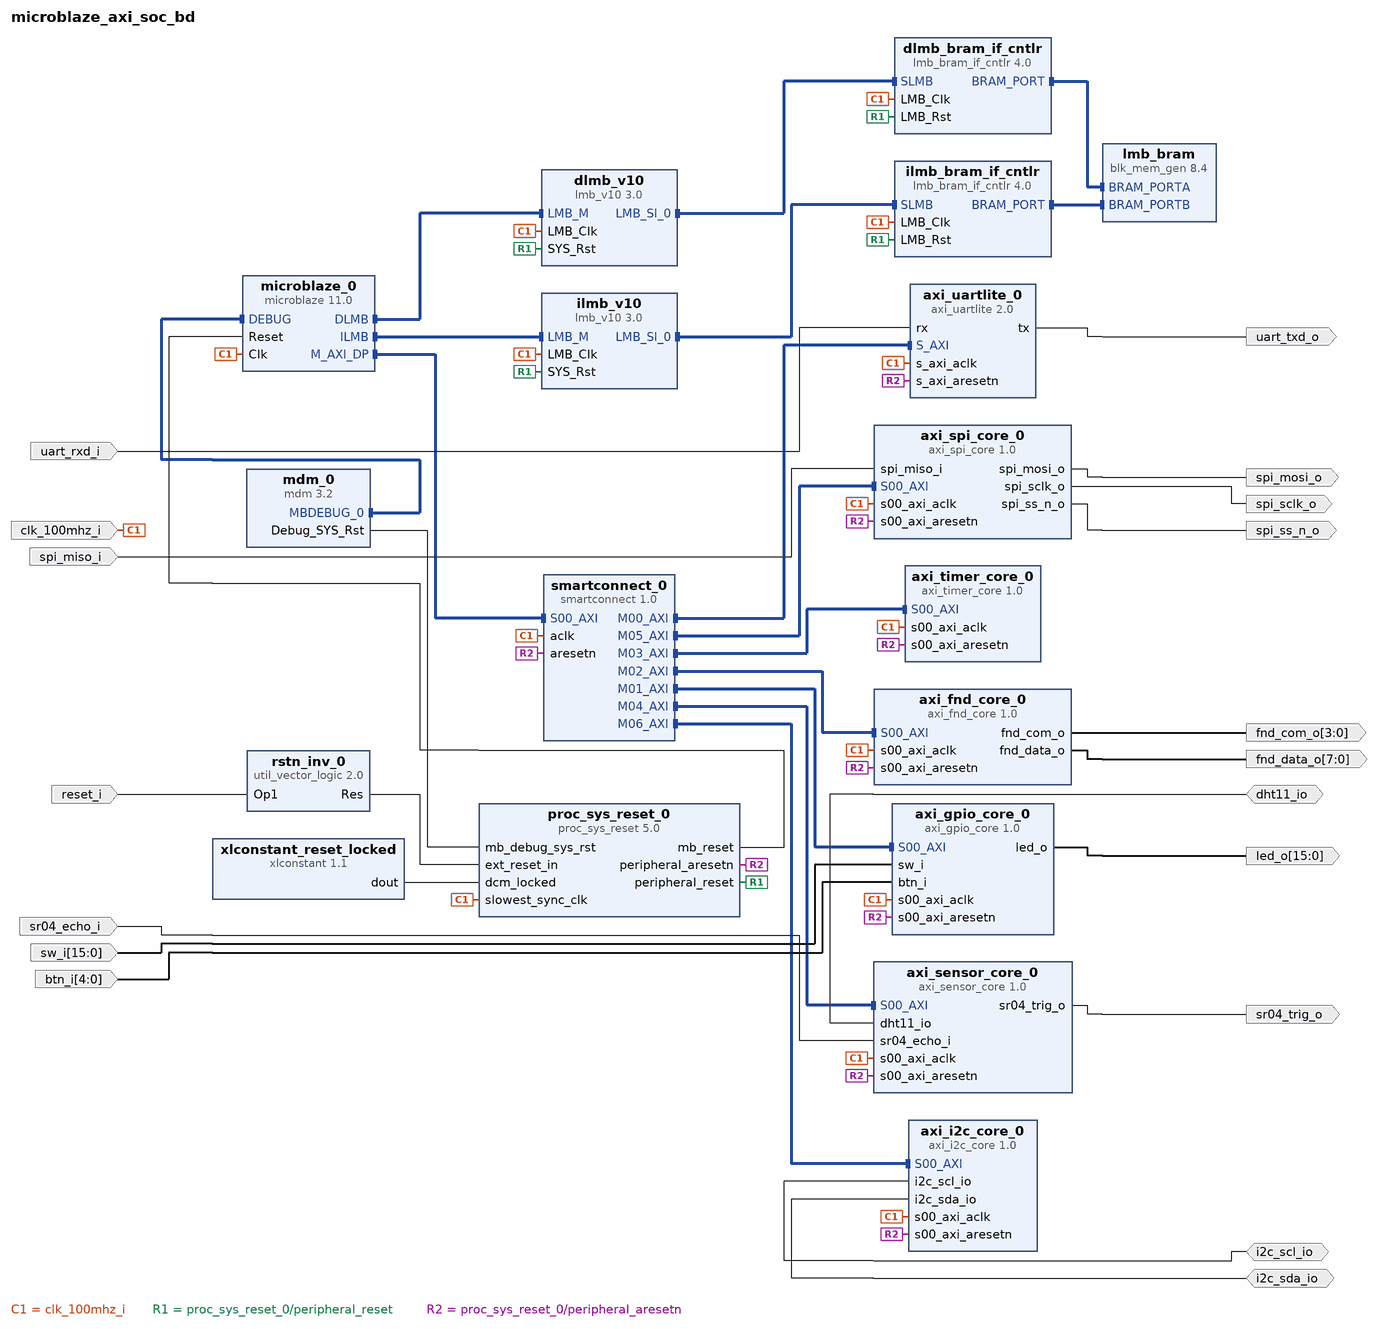
[diagram p0: block diagram of the top level]
# Vivado block design microblaze_axi_soc_bd, xc7a35tcpg236-1, Vivado 2020.2
create_bd_design microblaze_axi_soc_bd

create_bd_port -dir I -type clk clk_100mhz_i
set_property -dict {CONFIG.FREQ_HZ 100000000} [get_bd_ports clk_100mhz_i]
create_bd_port -dir I -type rst reset_i
set_property -dict {CONFIG.POLARITY ACTIVE_LOW} [get_bd_ports reset_i]
create_bd_port -dir I uart_rxd_i
create_bd_port -dir O uart_txd_o
create_bd_port -dir O -from 15 -to 0 led_o
create_bd_port -dir I -from 15 -to 0 sw_i
create_bd_port -dir I -from 4 -to 0 btn_i
create_bd_port -dir O -from 3 -to 0 fnd_com_o
create_bd_port -dir O -from 7 -to 0 fnd_data_o
create_bd_port -dir I sr04_echo_i
create_bd_port -dir O sr04_trig_o
create_bd_port -dir IO dht11_io
create_bd_port -dir O spi_sclk_o
create_bd_port -dir O spi_mosi_o
create_bd_port -dir I spi_miso_i
create_bd_port -dir O spi_ss_n_o
create_bd_port -dir IO i2c_scl_io
create_bd_port -dir IO i2c_sda_io

create_bd_cell -type ip -vlnv xilinx.com:ip:microblaze:11.0 microblaze_0
set_property -dict [list \
  CONFIG.C_DEBUG_ENABLED 1 \
  CONFIG.C_D_AXI 1 \
  CONFIG.C_D_LMB 1 \
  CONFIG.C_I_LMB 1 \
  CONFIG.C_USE_BARREL 1 \
  CONFIG.C_USE_HW_MUL 1 \
  CONFIG.C_USE_MSR_INSTR 1 \
  CONFIG.C_USE_PCMP_INSTR 1 \
] [get_bd_cells microblaze_0]
create_bd_cell -type ip -vlnv xilinx.com:ip:mdm:3.2 mdm_0
set_property -dict {CONFIG.C_USE_BSCAN 2} [get_bd_cells mdm_0]
create_bd_cell -type ip -vlnv xilinx.com:ip:proc_sys_reset:5.0 proc_sys_reset_0
create_bd_cell -type ip -vlnv xilinx.com:ip:xlconstant:1.1 xlconstant_reset_locked
set_property -dict {CONFIG.CONST_VAL 1 CONFIG.CONST_WIDTH 1} [get_bd_cells xlconstant_reset_locked]
create_bd_cell -type ip -vlnv xilinx.com:ip:lmb_v10:3.0 ilmb_v10
create_bd_cell -type ip -vlnv xilinx.com:ip:lmb_v10:3.0 dlmb_v10
create_bd_cell -type ip -vlnv xilinx.com:ip:lmb_bram_if_cntlr:4.0 ilmb_bram_if_cntlr
set_property -dict {CONFIG.C_ECC 0} [get_bd_cells ilmb_bram_if_cntlr]
create_bd_cell -type ip -vlnv xilinx.com:ip:lmb_bram_if_cntlr:4.0 dlmb_bram_if_cntlr
set_property -dict {CONFIG.C_ECC 0} [get_bd_cells dlmb_bram_if_cntlr]
create_bd_cell -type ip -vlnv xilinx.com:ip:blk_mem_gen:8.4 lmb_bram
set_property -dict [list \
  CONFIG.Assume_Synchronous_Clk true \
  CONFIG.Memory_Type True_Dual_Port_RAM \
  CONFIG.use_bram_block BRAM_Controller \
] [get_bd_cells lmb_bram]
create_bd_cell -type ip -vlnv xilinx.com:ip:smartconnect:1.0 smartconnect_0
set_property -dict {CONFIG.NUM_MI 7 CONFIG.NUM_SI 1} [get_bd_cells smartconnect_0]
create_bd_cell -type ip -vlnv xilinx.com:ip:axi_uartlite:2.0 axi_uartlite_0
set_property -dict {CONFIG.C_BAUDRATE 9600 CONFIG.C_DATA_BITS 8 CONFIG.C_USE_PARITY 0} [get_bd_cells axi_uartlite_0]
create_bd_cell -type ip -vlnv user.org:user:axi_gpio_core:1.0 axi_gpio_core_0
create_bd_cell -type ip -vlnv user.org:user:axi_fnd_core:1.0 axi_fnd_core_0
create_bd_cell -type ip -vlnv user.org:user:axi_timer_core:1.0 axi_timer_core_0
create_bd_cell -type ip -vlnv user.org:user:axi_sensor_core:1.0 axi_sensor_core_0
create_bd_cell -type ip -vlnv user.org:user:axi_spi_core:1.0 axi_spi_core_0
create_bd_cell -type ip -vlnv user.org:user:axi_i2c_core:1.0 axi_i2c_core_0
create_bd_cell -type ip -vlnv xilinx.com:ip:util_vector_logic:2.0 rstn_inv_0
set_property -dict {CONFIG.C_OPERATION not CONFIG.C_SIZE 1} [get_bd_cells rstn_inv_0]

# ---- connections ----

connect_bd_intf_net [get_bd_intf_pins ilmb_bram_if_cntlr/BRAM_PORT] [get_bd_intf_pins lmb_bram/BRAM_PORTB]
connect_bd_intf_net [get_bd_intf_pins smartconnect_0/M05_AXI] [get_bd_intf_pins axi_spi_core_0/S00_AXI]
connect_bd_intf_net [get_bd_intf_pins microblaze_0/M_AXI_DP] [get_bd_intf_pins smartconnect_0/S00_AXI]
connect_bd_intf_net [get_bd_intf_pins smartconnect_0/M02_AXI] [get_bd_intf_pins axi_fnd_core_0/S00_AXI]
connect_bd_intf_net [get_bd_intf_pins microblaze_0/DEBUG] [get_bd_intf_pins mdm_0/MBDEBUG_0]
connect_bd_intf_net [get_bd_intf_pins smartconnect_0/M00_AXI] [get_bd_intf_pins axi_uartlite_0/S_AXI]
connect_bd_intf_net [get_bd_intf_pins dlmb_bram_if_cntlr/BRAM_PORT] [get_bd_intf_pins lmb_bram/BRAM_PORTA]
connect_bd_intf_net [get_bd_intf_pins microblaze_0/ILMB] [get_bd_intf_pins ilmb_v10/LMB_M]
connect_bd_intf_net [get_bd_intf_pins smartconnect_0/M03_AXI] [get_bd_intf_pins axi_timer_core_0/S00_AXI]
connect_bd_intf_net [get_bd_intf_pins microblaze_0/DLMB] [get_bd_intf_pins dlmb_v10/LMB_M]
connect_bd_intf_net [get_bd_intf_pins smartconnect_0/M06_AXI] [get_bd_intf_pins axi_i2c_core_0/S00_AXI]
connect_bd_intf_net [get_bd_intf_pins smartconnect_0/M04_AXI] [get_bd_intf_pins axi_sensor_core_0/S00_AXI]
connect_bd_intf_net [get_bd_intf_pins smartconnect_0/M01_AXI] [get_bd_intf_pins axi_gpio_core_0/S00_AXI]
connect_bd_intf_net [get_bd_intf_pins ilmb_v10/LMB_Sl_0] [get_bd_intf_pins ilmb_bram_if_cntlr/SLMB]
connect_bd_intf_net [get_bd_intf_pins dlmb_v10/LMB_Sl_0] [get_bd_intf_pins dlmb_bram_if_cntlr/SLMB]
connect_bd_net [get_bd_ports clk_100mhz_i] \
  [get_bd_pins microblaze_0/Clk] [get_bd_pins proc_sys_reset_0/slowest_sync_clk] [get_bd_pins ilmb_v10/LMB_Clk] \
  [get_bd_pins dlmb_v10/LMB_Clk] [get_bd_pins ilmb_bram_if_cntlr/LMB_Clk] [get_bd_pins dlmb_bram_if_cntlr/LMB_Clk] \
  [get_bd_pins smartconnect_0/aclk] [get_bd_pins axi_uartlite_0/s_axi_aclk] [get_bd_pins axi_gpio_core_0/s00_axi_aclk] \
  [get_bd_pins axi_fnd_core_0/s00_axi_aclk] [get_bd_pins axi_timer_core_0/s00_axi_aclk] \
  [get_bd_pins axi_sensor_core_0/s00_axi_aclk] [get_bd_pins axi_spi_core_0/s00_axi_aclk] \
  [get_bd_pins axi_i2c_core_0/s00_axi_aclk]
connect_bd_net [get_bd_pins xlconstant_reset_locked/dout] [get_bd_pins proc_sys_reset_0/dcm_locked]
connect_bd_net [get_bd_pins mdm_0/Debug_SYS_Rst] [get_bd_pins proc_sys_reset_0/mb_debug_sys_rst]
connect_bd_net [get_bd_pins proc_sys_reset_0/mb_reset] [get_bd_pins microblaze_0/Reset]
connect_bd_net [get_bd_pins proc_sys_reset_0/peripheral_reset] \
  [get_bd_pins ilmb_v10/SYS_Rst] [get_bd_pins dlmb_v10/SYS_Rst] [get_bd_pins ilmb_bram_if_cntlr/LMB_Rst] \
  [get_bd_pins dlmb_bram_if_cntlr/LMB_Rst]
connect_bd_net [get_bd_pins proc_sys_reset_0/peripheral_aresetn] \
  [get_bd_pins smartconnect_0/aresetn] [get_bd_pins axi_uartlite_0/s_axi_aresetn] \
  [get_bd_pins axi_gpio_core_0/s00_axi_aresetn] [get_bd_pins axi_fnd_core_0/s00_axi_aresetn] \
  [get_bd_pins axi_timer_core_0/s00_axi_aresetn] [get_bd_pins axi_sensor_core_0/s00_axi_aresetn] \
  [get_bd_pins axi_spi_core_0/s00_axi_aresetn] [get_bd_pins axi_i2c_core_0/s00_axi_aresetn]
connect_bd_net [get_bd_ports uart_rxd_i] [get_bd_pins axi_uartlite_0/rx]
connect_bd_net [get_bd_pins axi_uartlite_0/tx] [get_bd_ports uart_txd_o]
connect_bd_net [get_bd_pins axi_gpio_core_0/led_o] [get_bd_ports led_o]
connect_bd_net [get_bd_ports sw_i] [get_bd_pins axi_gpio_core_0/sw_i]
connect_bd_net [get_bd_ports btn_i] [get_bd_pins axi_gpio_core_0/btn_i]
connect_bd_net [get_bd_pins axi_fnd_core_0/fnd_com_o] [get_bd_ports fnd_com_o]
connect_bd_net [get_bd_pins axi_fnd_core_0/fnd_data_o] [get_bd_ports fnd_data_o]
connect_bd_net [get_bd_ports sr04_echo_i] [get_bd_pins axi_sensor_core_0/sr04_echo_i]
connect_bd_net [get_bd_pins axi_sensor_core_0/sr04_trig_o] [get_bd_ports sr04_trig_o]
connect_bd_net [get_bd_ports dht11_io] [get_bd_pins axi_sensor_core_0/dht11_io]
connect_bd_net [get_bd_pins axi_spi_core_0/spi_sclk_o] [get_bd_ports spi_sclk_o]
connect_bd_net [get_bd_pins axi_spi_core_0/spi_mosi_o] [get_bd_ports spi_mosi_o]
connect_bd_net [get_bd_ports spi_miso_i] [get_bd_pins axi_spi_core_0/spi_miso_i]
connect_bd_net [get_bd_pins axi_spi_core_0/spi_ss_n_o] [get_bd_ports spi_ss_n_o]
connect_bd_net [get_bd_ports i2c_scl_io] [get_bd_pins axi_i2c_core_0/i2c_scl_io]
connect_bd_net [get_bd_ports i2c_sda_io] [get_bd_pins axi_i2c_core_0/i2c_sda_io]
connect_bd_net [get_bd_ports reset_i] [get_bd_pins rstn_inv_0/Op1]
connect_bd_net [get_bd_pins rstn_inv_0/Res] [get_bd_pins proc_sys_reset_0/ext_reset_in]
set_property HDL_ATTRIBUTE.BMM_INFO_PROCESSOR {microblaze-le > microblaze_axi_soc_bd dlmb_bram_if_cntlr} [get_bd_cells microblaze_0]
set_property HDL_ATTRIBUTE.KEEP_HIERARCHY yes [get_bd_cells microblaze_0]
set_property HDL_ATTRIBUTE.BMM_INFO_ADDRESS_SPACE {byte  0x00000000 32 > microblaze_axi_soc_bd lmb_bram} [get_bd_cells dlmb_bram_if_cntlr]
set_property HDL_ATTRIBUTE.KEEP_HIERARCHY yes [get_bd_cells dlmb_bram_if_cntlr]

# ---- address map ----
assign_bd_address -offset 0x00000000 -range 128K -target_address_space [get_bd_addr_spaces microblaze_0/Data] [get_bd_addr_segs dlmb_bram_if_cntlr/SLMB/Mem]
assign_bd_address -offset 0x40600000 -range 64K -target_address_space [get_bd_addr_spaces microblaze_0/Data] [get_bd_addr_segs axi_uartlite_0/S_AXI/Reg]
assign_bd_address -offset 0x44A00000 -range 64K -target_address_space [get_bd_addr_spaces microblaze_0/Data] [get_bd_addr_segs axi_gpio_core_0/s00_axi/reg0]
assign_bd_address -offset 0x44A10000 -range 64K -target_address_space [get_bd_addr_spaces microblaze_0/Data] [get_bd_addr_segs axi_fnd_core_0/s00_axi/reg0]
assign_bd_address -offset 0x44A20000 -range 64K -target_address_space [get_bd_addr_spaces microblaze_0/Data] [get_bd_addr_segs axi_timer_core_0/s00_axi/reg0]
assign_bd_address -offset 0x44A30000 -range 64K -target_address_space [get_bd_addr_spaces microblaze_0/Data] [get_bd_addr_segs axi_sensor_core_0/s00_axi/reg0]
assign_bd_address -offset 0x44A40000 -range 64K -target_address_space [get_bd_addr_spaces microblaze_0/Data] [get_bd_addr_segs axi_spi_core_0/s00_axi/reg0]
assign_bd_address -offset 0x44A50000 -range 64K -target_address_space [get_bd_addr_spaces microblaze_0/Data] [get_bd_addr_segs axi_i2c_core_0/s00_axi/reg0]
assign_bd_address -offset 0x00000000 -range 128K -target_address_space [get_bd_addr_spaces microblaze_0/Instruction] [get_bd_addr_segs ilmb_bram_if_cntlr/SLMB/Mem]

validate_bd_design
save_bd_design
